# EAGLE design input-selector (EAGLE 7.6.0)
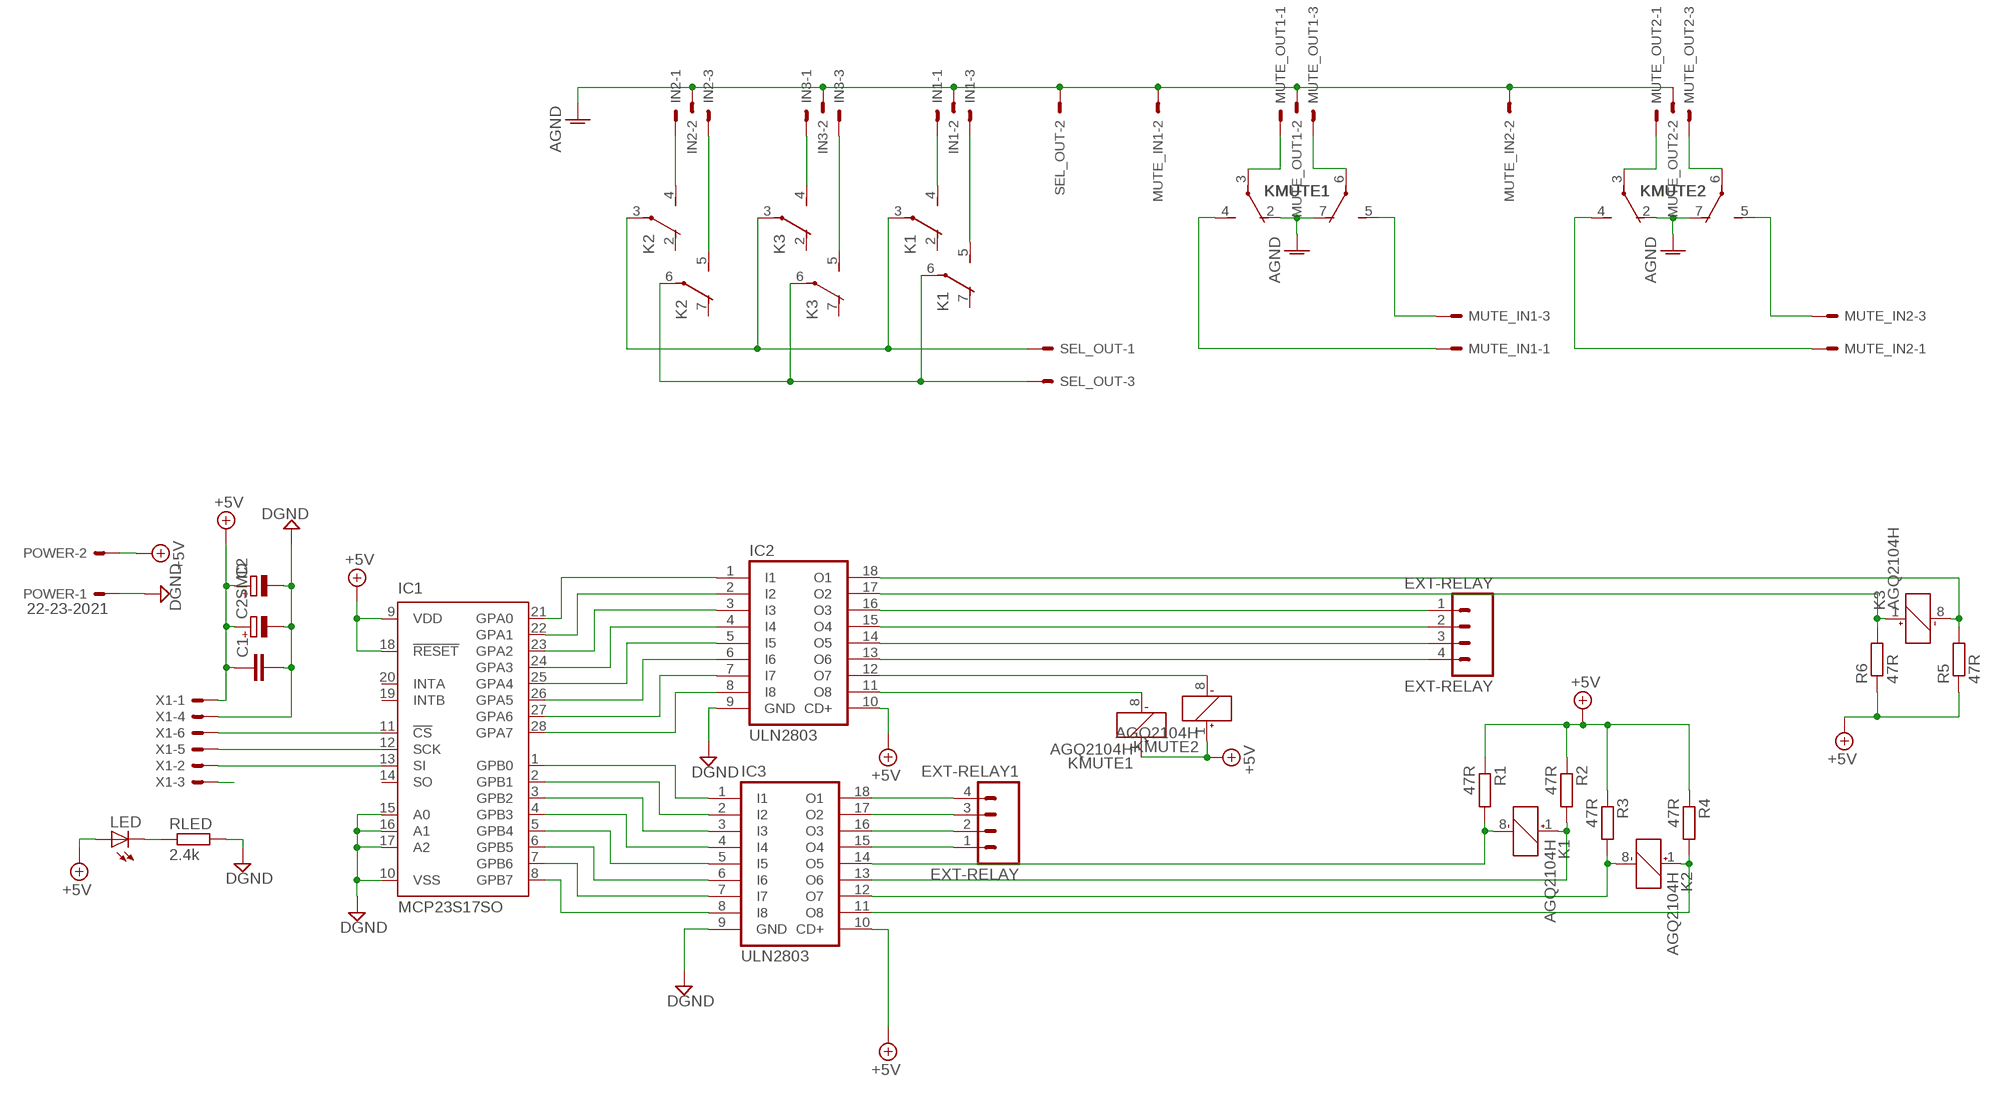
[diagram p0: schematic, sheet 1]

## Parts
C1  C-EUC1206  [C1206]
C2  CPOL-EUE3.5-8  [E3,5-8]
C2SMD  CPOL-EUE  [PANASONIC_E]
EXT-RELAY  EXT-RELAY  M04POLAR  [MOLEX-1X4]
EXT-RELAY1  EXT-RELAY  M04POLAR  [MOLEX-1X4]
IC1  MCP23S17SO  [SO28W]
IC2  ULN2803  ULN2803ADW  [SO-18W]
IC3  ULN2803  ULN2803ADW  [SO-18W]
IN1  22-23-2031  [22-23-2031]
IN2  22-23-2031  [22-23-2031]
IN3  22-23-2031  [22-23-2031]
K1  AGQ2104H  [PCBBOARD]
K2  AGQ2104H  [PCBBOARD]
K3  AGQ2104H  [PCBBOARD]
KMUTE1  AGQ2104H  [PCBBOARD]
KMUTE2  AGQ2104H  [PCBBOARD]
LED  LEDSMT1206  [1206]
MUTE_IN1  22-23-2031  [22-23-2031]
MUTE_IN2  22-23-2031  [22-23-2031]
MUTE_OUT1  22-23-2031  [22-23-2031]
MUTE_OUT2  22-23-2031  [22-23-2031]
POWER  22-23-2021  [22-23-2021]
R1  47R  R-EU_R1206  [R1206]
R2  47R  R-EU_R1206  [R1206]
R3  47R  R-EU_R1206  [R1206]
R4  47R  R-EU_R1206  [R1206]
R5  47R  R-EU_R1206  [R1206]
R6  47R  R-EU_R1206  [R1206]
RLED  2.4k  R-EU_R1206  [R1206]
SEL_OUT  22-23-2031  [22-23-2031]
X1  22-23-2061  [22-23-2061]

## Nets
+5V: C1.1 C2.+ C2SMD.+ IC1.9(VDD) IC1.18(!RESET) IC2.10(CD+) IC3.10(CD+) KMUTE1.1(+) KMUTE2.1(+) LED.A POWER.2 R1.1 R2.1 R3.1 R4.1 R5.1 R6.1 X1.1
AGND: IN1.2 IN2.2 IN3.2 KMUTE1.2(O) KMUTE1.7(O) KMUTE2.2(O) KMUTE2.7(O) MUTE_IN1.2 MUTE_IN2.2 MUTE_OUT1.2 MUTE_OUT2.2 SEL_OUT.2
CLK: IC1.12(SCK) X1.5
CS: IC1.11(!CS) X1.6
DGND: C1.2 C2.- C2SMD.- IC1.10(VSS) IC1.15(A0) IC1.16(A1) IC1.17(A2) IC2.9(GND) IC3.9(GND) POWER.1 RLED.2 X1.4
INL: K1.3(P) K2.3(P) K3.3(P) SEL_OUT.1
INR: K1.6(P) K2.6(P) K3.6(P) SEL_OUT.3
N$1: IN1.1 K1.4(S)
N$2: EXT-RELAY1.1 IC3.15(O4)
N$3: IN1.3 K1.5(S)
N$4: EXT-RELAY1.2 IC3.16(O3)
N$5: IC3.14(O5) K1.8(-) R1.2
N$6: IC2.11(O8) KMUTE1.8(-)
N$7: IC1.21(GPA0) IC2.1(I1)
N$8: IC3.13(O6) K1.1(+) R2.2
N$9: IC3.12(O7) K2.8(-) R3.2
N$10: EXT-RELAY1.3 IC3.17(O2)
N$11: EXT-RELAY.1 IC2.16(O3)
N$12: IC3.11(O8) K2.1(+) R4.2
N$13: EXT-RELAY1.4 IC3.18(O1)
N$14: IC2.18(O1) K3.8(-) R5.2
N$15: EXT-RELAY.2 IC2.15(O4)
N$16: EXT-RELAY.4 IC2.13(O6)
N$17: KMUTE1.6(P) MUTE_OUT1.3
N$18: KMUTE1.3(P) MUTE_OUT1.1
N$19: IC2.12(O7) KMUTE2.8(-)
N$20: KMUTE2.6(P) MUTE_OUT2.3
N$21: IC1.23(GPA2) IC2.3(I3)
N$22: IC2.17(O2) K3.1(+) R6.2
N$23: EXT-RELAY.3 IC2.14(O5)
N$24: KMUTE2.3(P) MUTE_OUT2.1
N$31: IN2.1 K2.4(S)
N$32: IN2.3 K2.5(S)
N$33: IN3.1 K3.4(S)
N$34: IN3.3 K3.5(S)
N$37: IC1.25(GPA4) IC2.5(I5)
N$39: IC1.27(GPA6) IC2.7(I7)
N$41: IC1.1(GPB0) IC3.1(I1)
N$42: IC1.2(GPB1) IC3.2(I2)
N$43: IC1.3(GPB2) IC3.3(I3)
N$44: IC1.4(GPB3) IC3.4(I4)
N$45: IC1.5(GPB4) IC3.5(I5)
N$46: IC1.6(GPB5) IC3.6(I6)
N$47: IC1.7(GPB6) IC3.7(I7)
N$48: IC1.8(GPB7) IC3.8(I8)
N$51: IC1.22(GPA1) IC2.2(I2)
N$53: IC1.24(GPA3) IC2.4(I4)
N$55: IC1.26(GPA5) IC2.6(I6)
N$57: IC1.28(GPA7) IC2.8(I8)
N$67: LED.C RLED.1
NC: X1.3
OUTL: KMUTE1.4(S) MUTE_IN1.1
OUTL1: KMUTE2.4(S) MUTE_IN2.1
OUTR: KMUTE1.5(S) MUTE_IN1.3
OUTR1: KMUTE2.5(S) MUTE_IN2.3
SDI: IC1.13(SI) X1.2
Unconnected: IC1.14(SO) IC1.19(INTB) IC1.20(INTA) K1.2(O) K1.7(O) K2.2(O) K2.7(O) K3.2(O) K3.7(O)

## Library data of the parts
C1 = rcl:C-EU: CAPACITOR, European symbol
C2 C2SMD = rcl:CPOL-EU: POLARIZED CAPACITOR, European symbol
EXT-RELAY EXT-RELAY1 = SparkFun-Connectors:M04: Header 4 Standard 4-pin 0.1" header. Use with straight break away headers (SKU : PRT-00116), right angle break away headers (PRT-00553), swiss pins (PRT-00743), machine pins (PRT-00117), and female headers (PRT-00115). Molex polarized connector foot print use with SKU : PRT-08231 with associated crimp pins and housings. 1MM SMD Version SKU: PRT-10208
IC1 = microchip:MCP23S17: http://ww1.microchip.com/downloads/en/DeviceDoc/21952a.pdf Source: http://ww1.microchip.com/downloads/en/DeviceDoc/21952a.pdf; MF: MICROCHIP; MPN: MCP23S17-E/SO; OC_FARNELL: unknown; OC_NEWARK: 31K2950
IC2 IC3 = uln-udn-mine:ULN2803ADW
IN1-IN3 MUTE_IN1 MUTE_IN2 MUTE_OUT1 MUTE_OUT2 SEL_OUT = con-molex:22-23-2031: .100" (2.54mm) Center Header - 3 Pin; MF: MOLEX; MPN: 22-23-2031; OC_FARNELL: 1462950; OC_NEWARK: 30C0862
K1-K3 KMUTE1 KMUTE2 = panasonic-agq:AGQ2104H: Panasonic AGQ RELAYS High sensitivity single side stable type (Nominal operating power: 100mW) is available Outstanding surge resistance The use of twin crossbar contacts ensures high contact reliability Datasheet URL: http://www3.panasonic.biz/ac/e_download/control/relay/signal/catalog/mech_eng_gq.pdf
LED = led:LED: LED OSRAM: - CHIPLED LG R971, LG N971, LY N971, LG Q971, LY Q971, LO R971, LY R971 LH N974, LH R974 LS Q976, LO Q976, LY Q976 LO Q996 - Hyper CHIPLED LW Q18S LB Q993, LB Q99A, LB R99A - SideLED LS A670, LO A670, LY A670, LG A670, LP A670 LB A673, LV A673, LT A673, LW A673 LH A674 LY A675 LS A676, LA A676, LO A676, LY A676, LW A676 LS A679, LY A679, LG A679 - Hyper Micro SIDELED® LS Y876, LA Y876, LO Y876, LY Y876 LT Y87S - SmartLED LW L88C, LW L88S LB L89C, LB L89S, LG L890 LS L89K, LO L89K, LY L89K LS L896, LA L896, LO L896, LY L896 - TOPLED LS T670, LO T670, LY T670, LG T670, LP T670 LSG T670, LSP T670, LSY T670, LOP T670, LYG T670 LG T671, LOG T671, LSG T671 LB T673, LV T673, LT T673, LW T673 LH T674 LS T676, LA T676, LO T676, LY T676, LB T676, LH T676, LSB T676, LW T676 LB T67C, LV T67C, LT T67C, LS T67K, LO T67K, LY T67K, LW E67C LS E67B, LA E67B, LO E67B, LY E67B, LB E67C, LV E67C, LT E67C LW T67C LS T679, LY T679, LG T679 LS T770, LO T770, LY T770, LG T770, LP T770 LB T773, LV T773, LT T773, LW T773 LH T774 LS E675, LA E675, LY E675, LS T675 LS T776, LA T776, LO T776, LY T776, LB T776 LHGB T686 LT T68C, LB T68C - Hyper Mini TOPLED® LB M676 - Mini TOPLED Santana® LG M470 LS M47K, LO M47K, LY M47K Source: http://www.osram.convergy.de LUXEON: - LUMILED® LXK2-PW12-R00, LXK2-PW12-S00, LXK2-PW14-U00, LXK2-PW14-V00 LXK2-PM12-R00, LXK2-PM12-S00, LXK2-PM14-U00 LXK2-PE12-Q00, LXK2-PE12-R00, LXK2-PE12-S00, LXK2-PE14-T00, LXK2-PE14-U00 LXK2-PB12-K00, LXK2-PB12-L00, LXK2-PB12-M00, LXK2-PB14-N00, LXK2-PB14-P00, LXK2-PB14-Q00 LXK2-PR12-L00, LXK2-PR12-M00, LXK2-PR14-Q00, LXK2-PR14-R00 LXK2-PD12-Q00, LXK2-PD12-R00, LXK2-PD12-S00 LXK2-PH12-R00, LXK2-PH12-S00 LXK2-PL12-P00, LXK2-PL12-Q00, LXK2-PL12-R00 Source: www.luxeon.com KINGBRIGHT: KA-3528ASYC Source: www.kingbright.com
POWER = con-molex:22-23-2021: .100" (2.54mm) Center Header - 2 Pin; MF: MOLEX; MPN: 22-23-2021; OC_FARNELL: 1462926; OC_NEWARK: 25C3832
R1-R6 RLED = rcl:R-EU_: RESISTOR, European symbol
X1 = con-molex:22-23-2061: .100" (2.54mm) Center Header - 6 Pin; MF: MOLEX; MPN: 22-23-2061; OC_FARNELL: 1462922; OC_NEWARK: 27C1933

## Board
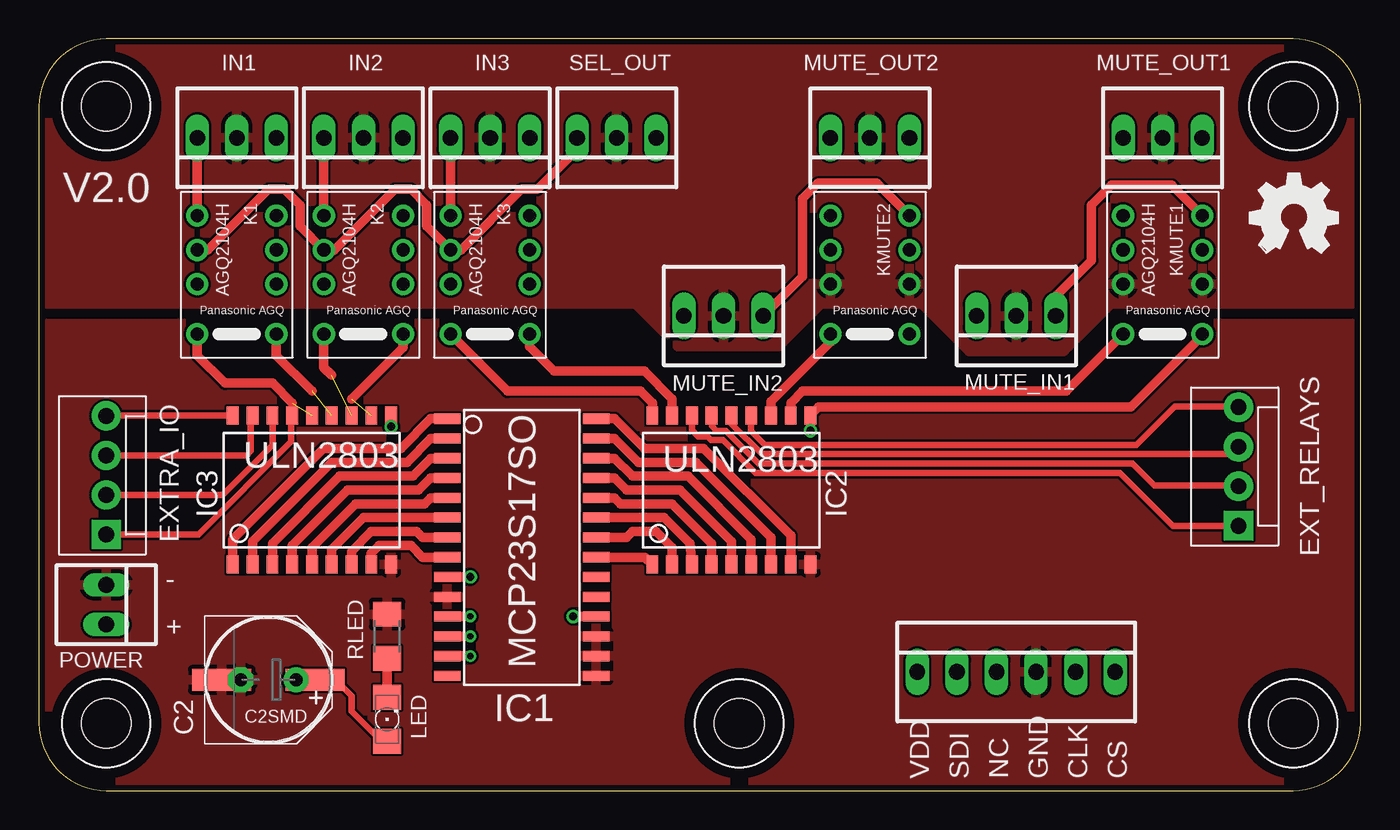
[diagram p1: board, top side]
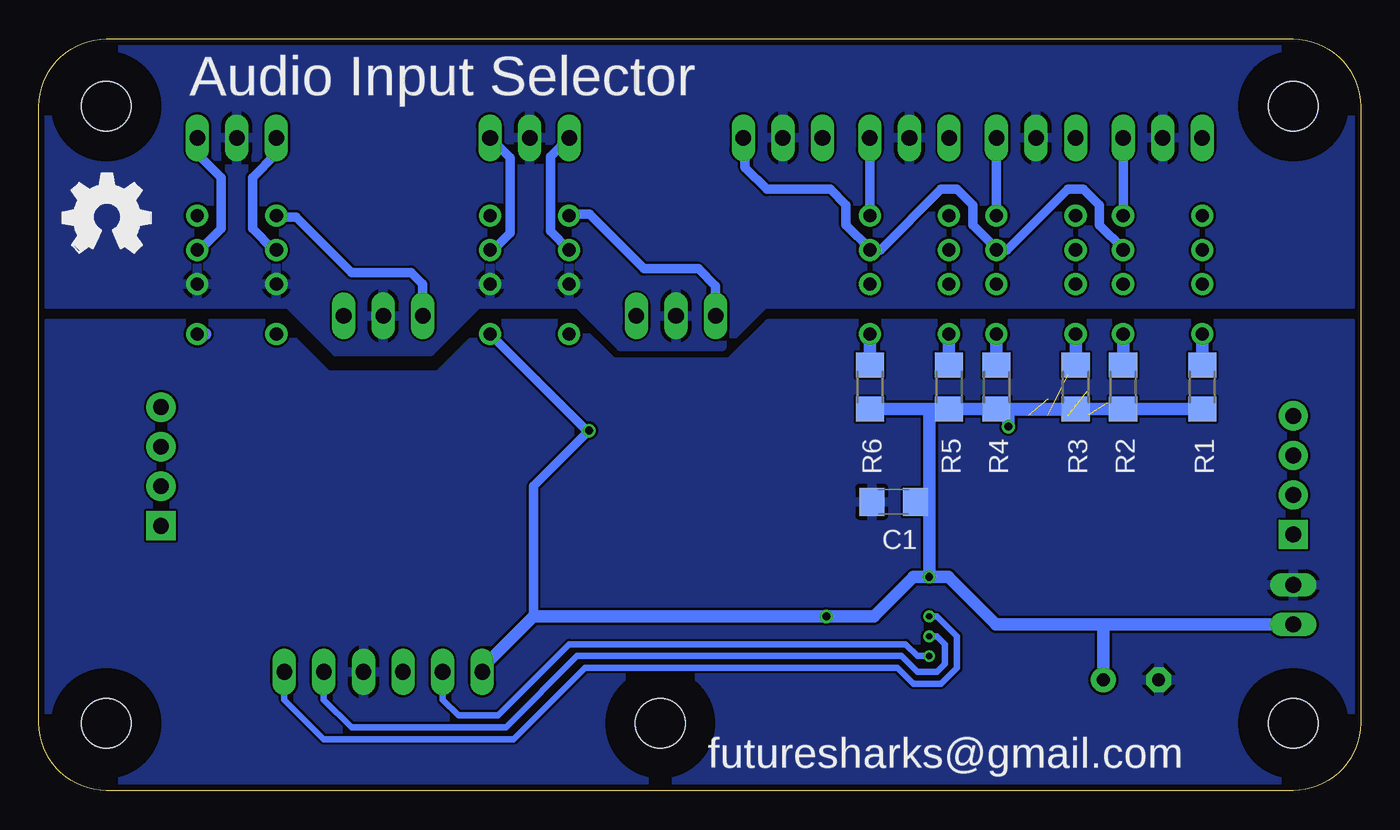
[diagram p2: board, bottom side, seen from below]

Size 84.84 x 48.26 mm. Coordinates in mm from the lower left corner, seen from the top.
Outline: 4.32,0 80.52,0 arc90 84.84,4.32 84.84,43.94 arc90 80.52,48.26 4.32,48.26 arc90 0,43.94 0,4.32 arc90 4.32,0
Copper layers (1*16): Top 0.0356mm / dielectric 1.5011mm / Bottom 0.0356mm
Design rules "LaenPCBOrder": minimum track width 6mil, minimum drill 13mil, track to track 6mil, track to pad 6mil, pad to pad 6mil, via to via 6mil, smd to smd 6mil, copper to edge 15mil, drill to drill 6mil, minimum pad ring 7mil, minimum via ring 7mil, stop-mask expansion 3mil, vias tented up to drill 0mil, thermal gap 10mil

### Footprints (pad centres in the part's own frame; a part is rotated, then mirrored left to right if it is on the bottom)
C1206 = smd 1.6 x 1.8: 1 -1.4,0; 2 1.4,0
E3,5-8 = drill 0.813 pad 1.6: + -1.778,0 | drill 0.813 pad 1.6 octagon: - 1.778,0
PANASONIC_E = smd 3.8 x 1.4: + 3,0; - -3,0
MOLEX-1X4 = drill 1.016 pad 1.88 square: 1 0,0 | drill 1.016 pad 1.88: 2 2.54,0; 3 5.08,0; 4 7.62,0
SO28W = smd 0.65 x 1.7: 1 -7.62,-4.78; 2 -6.35,-4.78; 3 -5.08,-4.78; 4 -3.81,-4.78; 5 -2.54,-4.78; 6 -1.27,-4.78; 7 0,-4.78; 8 1.27,-4.78; 9 2.54,-4.78; 10 3.81,-4.78; 11 5.08,-4.78; 12 6.35,-4.78; 13 7.62,-4.78; 14 8.89,-4.78; 15 8.89,4.78; 16 7.62,4.78; 17 6.35,4.78; 18 5.08,4.78; 19 3.81,4.78; 20 2.54,4.78; 21 1.27,4.78; 22 0,4.78; 23 -1.27,4.78; 24 -2.54,4.78; 25 -3.81,4.78; 26 -5.08,4.78; 27 -6.35,4.78; 28 -7.62,4.78
SO-18W = smd 0.762 x 1.143: 1 -5.08,-4.788; 2 -3.81,-4.788; 3 -2.54,-4.788; 4 -1.27,-4.788; 5 0,-4.788; 6 1.27,-4.788; 7 2.54,-4.788; 8 3.81,-4.788; 9 5.08,-4.788; 10 5.08,4.788; 11 3.81,4.788; 12 2.54,4.788; 13 1.27,4.788; 14 0,4.788; 15 -1.27,4.788; 16 -2.54,4.788; 17 -3.81,4.788; 18 -5.08,4.788
22-23-2031 = drill 1 long: 1 -2.54,0; 2 0,0; 3 2.54,0
PCBBOARD = drill 0.85 pad 1.422: 1 -2.54,3.2; 2 -2.54,0; 3 -2.54,-2.2; 4 -2.54,-4.4; 5 2.54,-4.4; 6 2.54,-2.2; 7 2.54,0; 8 2.54,3.2
1206 = smd 1.6 x 1.803: A -1.422,0; C 1.422,0
22-23-2021 = drill 1 long: 1 -1.27,0; 2 1.27,0
R1206 = smd 1.6 x 1.803: 1 -1.422,0; 2 1.422,0
M3_HOLE = hole 3.2: 0,0
22-23-2061 = drill 1 long: 1 -6.35,0; 2 -3.81,0; 3 -1.27,0; 4 1.27,0; 5 3.81,0; 6 6.35,0

### Placement (x,y rotation side)
C1  29.97,18.54 180 bottom
C2  14.73,7.11 180 top
C2SMD  14.73,7.11 0 top
EXT-RELAY  77,17 90 top
EXT-RELAY1  4.32,16.44 90 top
IC1  30.99,16.26 270 top
IC2  44.45,19.3 0 top
IC3  17.53,19.3 0 top
IN1  12.7,41.91 180 top
IN2  20.83,41.91 180 top
IN3  28.96,41.91 180 top
K1  12.7,32.51 180 top
K2  20.83,32.51 180 top
K3  28.96,32.51 180 top
KMUTE1  72.14,32.51 180 top
KMUTE2  53.34,32.51 180 top
LED  22.35,4.57 90 top
LOGO1  OSHW_LOGO_FILLX0200-NT  [OSHW_FILLX200_NOTEXT]  83.31,34.54 0 bottom
LOGO2  OSHW_LOGO_FILLX0200-NT  [OSHW_FILLX200_NOTEXT]  77.72,34.54 0 top
MUTE_IN1  62.74,30.48 180 top
MUTE_IN2  43.94,30.48 180 top
MUTE_OUT1  72.14,41.91 180 top
MUTE_OUT2  53.34,41.91 180 top
POWER  4.32,11.94 270 top
R1  10.16,25.91 90 bottom
R2  15.24,25.91 90 bottom
R3  18.29,25.91 90 bottom
R4  23.37,25.91 90 bottom
R5  26.42,25.91 90 bottom
R6  31.5,25.91 90 bottom
RLED  22.35,9.91 90 top
SEL_OUT  37.08,41.91 180 top
U$1  [M3_HOLE]  4.32,43.94 0 top
U$2  [M3_HOLE]  4.32,4.32 0 top
U$3  [M3_HOLE]  44.96,4.32 0 top
U$4  [M3_HOLE]  80.52,4.32 0 top
U$5  [M3_HOLE]  80.52,43.94 0 top
X1  62.74,7.62 0 top

### Tracks (layer width: path | path; a pad name or v marks a point on that pad's centre or on a via)
+5V  (via drill 0.5)
  Top 0.406: LED.A 22,3.15 20.07,5.08 20.07,6.1 19.05,7.11 C2SMD.+
  Top 0.61: IC3.10 v22.61,23.37 | IC2.10 v49.53,23.11 49.53,24.13 50.04,24.64 70.1,24.64 74.68,29.21 KMUTE1.1 | IC1.9 v27.69,13.72 | IC1.18 v34.29,11.18
  Top 0.813: C2SMD.+ C2.+
  Bottom 0.61: C1.1 27.69,18.54 | R6.1 27.79,24.49 27.69,24.38 26.52,24.38 R5.1 | R4.1 23,24.49 IC3.10 | 22.61,24.38 18.39,24.38 R3.1 | KMUTE2.1 49.68,23.11 v49.53,23.11 53.09,19.56 53.09,11.18
  Bottom 0.813: R1.1 R2.1 R3.1 R4.1 R5.1 R6.1 | v27.69,13.72 28.7,13.72 31.24,11.18 v34.29,11.18 53.09,11.18 56.39,7.87 X1.1 | v27.69,13.72 27.69,18.54 27.69,24.38 | v22.61,23.37 IC3.10 22.61,24.38 | POWER.2 16.51,10.67 | 16.51,10.67 23.41,10.67 26.46,13.72 v27.69,13.72 | 16.51,10.67 C2.+ | KMUTE1.1 74.17,29.31
AGND
  pour Bottom: 0.51,47.75 0.51,31.24 38.26,31.24 41,28.5 47.5,28.5 50.24,31.24 56.64,31.24 59.69,28.19 65.79,28.19 68.83,31.24 84.33,31.24 84.33,47.75
  pour Top: 84.33,47.75 84.33,31.24 68.83,31.24 65.79,28.19 59.69,28.19 56.64,31.24 50.24,31.24 47.5,28.5 41,28.5 38.26,31.24 0.51,31.24 0.51,47.75
CLK  (via drill 0.4)
  Top 0.61: IC1.12 v27.69,9.91
  Bottom 0.406: v27.69,9.91 27.18,9.91 26.67,9.4 26.67,8.13 27.18,7.62 28.45,7.62 29.46,8.64 50.29,8.64 54.86,4.06 64.77,4.06 66.55,5.84 X1.5
CS  (via drill 0.4)
  Top 0.61: IC1.11 v27.69,11.18
  Bottom 0.406: v27.69,11.18 27.18,11.18 25.91,9.91 25.91,7.87 26.92,6.86 28.7,6.86 29.72,7.87 49.78,7.87 54.36,3.3 66.55,3.3 69.09,5.84 X1.6
DGND
  pour Bottom: 0.51,29.97 0.51,0.51 84.33,0.51 84.33,29.97 69.6,29.97 66.29,26.67 59.18,26.67 55.88,29.97 50.47,29.97 48,27.5 40.5,27.5 38,30
  pour Top: 0.51,29.97 0.51,0.51 84.33,0.51 84.33,29.97 69.85,29.97 66.04,26.16 59.44,26.16 55.37,29.97 50.47,29.97 48,27.5 40.5,27.5 38,30
INL
  Bottom 0.61: K1.3 15.24,34.8 16.76,36.32 16.76,37.59 17.78,38.61 18.8,38.61 22.69,34.71 K2.3 23.37,34.8 24.89,36.32 24.89,37.59 25.91,38.61 26.92,38.61 30.82,34.71 K3.3 31.5,34.8 33.02,36.32 33.02,37.59 34.04,38.61 38.11,38.61 39.5,40 39.5,41.79 SEL_OUT.1
INR
  Top 0.61: K1.6 10.84,34.71 14.73,38.61 15.75,38.61 16.76,37.59 16.76,36.24 K2.6 18.96,34.71 22.86,38.61 23.88,38.61 24.89,37.59 24.89,36.24 K3.6 27.09,34.71 30.99,38.61 32,38.61 34.54,41.15 SEL_OUT.3
N$1
  Bottom 0.61: K1.4 IN1.1
N$2
  Top 0.406: EXT-RELAY1.1 10.24,16.44 16.2,22.4 16.2,24.04 IC3.15
N$3
  Top 0.61: K1.5 IN1.3
N$4
  Top 0.406: EXT-RELAY1.2 11.78,18.98 15,22.2 15,24.08 IC3.16
N$5  (1 unrouted)
  Top 0.61: 16.26,24.89 14.99,26.16 11.94,26.16 10.16,27.94 K1.8
  Bottom 0.813: R1.2 K1.8
N$6
  Top 0.61: IC2.11 48.26,24.89 49.02,25.65 65.94,25.65 KMUTE1.8
N$7
  Top 0.61: IC1.21 38.9,14.99 IC2.1
N$8  (1 unrouted)
  Top 0.61: 17.53,25.65 15.24,27.94 K1.1
  Bottom 0.813: R2.2 K1.1
N$9  (1 unrouted)
  Top 0.61: 18.8,26.67 18.29,27.18 K2.8
  Bottom 0.813: R3.2 K2.8
N$10
  Top 0.406: EXT-RELAY1.3 13.32,21.52 13.6,21.8 13.6,23.98 IC3.17
N$11
  Top 0.406: IC2.16 41.91,23.14 42.3,22.75 42.9,22.75 43.15,22.5 43.9,22.5 46,20.4 69.4,20.4 72.8,17 EXT-RELAY.1
N$12  (1 unrouted)
  Top 0.61: 20.07,25.15 23.37,28.45 K2.1
  Bottom 0.813: R4.2 K2.1
N$13
  Top 0.406: IC3.18 4.35,24.09 EXT-RELAY1.4
N$14
  Top 0.61: IC2.18 39.37,24.89 38.61,25.65 30.07,25.65 K3.8
  Bottom 0.813: R5.2 K3.8
N$15
  Top 0.406: EXT-RELAY.2 76.94,19.6 71.6,19.6 70.2,21 46.2,21 44.1,23.1 43.5,23.1 43.2,23.4 43.2,24.07 IC2.15
N$16
  Top 0.406: 45.8,24.01 IC2.13 45.72,23.08 46.6,22.2 70.45,22.2 72.9,24.65 76.97,24.65 EXT-RELAY.4
N$17
  Bottom 0.61: KMUTE1.6 69.76,34.71 71.12,36.07 71.12,39.37 69.6,40.89 MUTE_OUT1.3
N$18
  Bottom 0.61: KMUTE1.3 74.51,34.71 73.15,36.07 73.15,39.37 74.68,40.89 MUTE_OUT1.1
N$19
  Top 0.61: IC2.12 46.99,24.99 50.8,28.8 KMUTE2.8
N$20
  Bottom 0.61: MUTE_OUT2.3 52,40.71 52,35.91 KMUTE2.6
N$21
  Top 0.61: IC2.3 41.78,15.88 40.13,17.53 IC1.23
N$22
  Top 0.61: IC2.17 40.64,25.15 38.86,26.92 33.07,26.92 31.5,28.5 K3.1
  Bottom 0.813: R6.2 K3.1
N$23
  Top 0.406: EXT-RELAY.3 76.52,21.6 46.4,21.6 44.48,23.52 44.48,24.06 IC2.14 44.45,24.05
N$24
  Bottom 0.61: MUTE_OUT2.1 54.6,40.63 54.6,35.8 55.69,34.71 KMUTE2.3
N$31
  Bottom 0.61: K2.4 IN2.1
N$32
  Top 0.61: K2.5 IN2.3
N$33
  Bottom 0.61: K3.4 IN3.1
N$34
  Top 0.61: K3.5 IN3.3
N$37
  Top 0.61: IC2.5 44.45,16 41.15,19.3 37.72,19.3 36.96,20.07 IC1.25
N$39
  Top 0.61: IC2.7 46.99,16.26 42.16,21.08 38.48,21.08 36.96,22.61 IC1.27
N$41
  Top 0.61: IC3.1 12.45,16.13 18.29,21.97 23.24,21.97 25.15,23.88 IC1.1
N$42
  Top 0.61: IC3.2 13.72,16 18.8,21.08 23.62,21.08 25.15,22.61 IC1.2
N$43
  Top 0.61: IC3.3 14.99,15.88 19.3,20.19 24,20.19 25.15,21.34 IC1.3
N$44
  Top 0.61: IC3.4 16.26,15.75 19.81,19.3 24.38,19.3 25.15,20.07 IC1.4
N$45
  Top 0.61: IC3.5 17.53,15.62 20.32,18.41 24.77,18.41 25.15,18.8 IC1.5
N$46
  Top 0.61: IC3.6 18.8,15.49 20.83,17.53 IC1.6
N$47
  Top 0.61: IC3.7 20.07,15.37 21.34,16.64 24.26,16.64 24.64,16.26 IC1.7
N$48
  Top 0.61: IC3.8 21.34,15.24 21.84,15.75 23.88,15.75 24.64,14.99 IC1.8
N$51
  Top 0.61: IC2.2 40.64,15.62 39.62,16.64 38.1,16.64 37.72,16.26 IC1.22
N$53
  Top 0.61: IC2.4 43.18,15.88 40.64,18.41 37.34,18.41 36.96,18.8 IC1.24
N$55
  Top 0.61: IC2.6 45.72,16.13 41.66,20.19 38.1,20.19 36.96,21.34 IC1.26
N$57
  Top 0.61: IC2.8 48.26,16.38 42.67,21.97 38.86,21.97 36.96,23.88 IC1.28
N$67
  Top 0.61: RLED.1 LED.C
OUTL
  Top 0.61: MUTE_IN1.1 65.28,31.75 67.56,34.04 67.56,37.59 68.83,38.86 72.73,38.86 KMUTE1.4
OUTL1
  Top 0.61: KMUTE2.4 53.79,39 50,39 49,38 49,33 MUTE_IN2.1
OUTR
  Bottom 0.61: KMUTE1.5 69.6,36.83 68.33,36.83 64.77,33.27 60.96,33.27 60.2,32.51 MUTE_IN1.3
OUTR1
  Bottom 0.61: MUTE_IN2.3 41.4,32.4 42.5,33.5 46,33.5 49.5,37 50.71,37 KMUTE2.5
SDI  (via drill 0.4)
  Top 0.61: IC1.13 v27.69,8.64
  Bottom 0.406: X1.2 58.93,5.84 57.91,4.83 55.37,4.83 50.8,9.4 29.21,9.4 28.45,8.64 v27.69,8.64

### Text on the board
tPlace: EXT_RELAYS | EXTRA_IO
tNames: V2.0 | - | + | VDD | SDI | NC | GND | CLK | CS
bNames: Audio Input Selector | futuresharks@gmail.com